# Altium schematic sheet Motor_Driver_Schematic.SchDoc
size A; DocumentNumber: 4; SheetNumber: 4; SheetTotal: 4
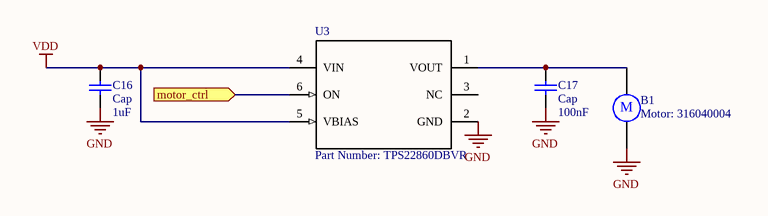
[diagram p0: Motor_Driver_Schematic.SchDoc]

## Parts
B1  Motor: 316040004  [RB5-10.5]
C16  Cap  value 1uF  [C0805]
C17  Cap  value 100nF  [C0805]
U3  Part Number: TPS22860DBVR  [DBV0006A_N]

## Ports
motor_ctrl (in)

## Nets
GND: B1.2 C16.1 C17.1 U3.2(GND)
VDD: C16.2 U3.4(VIN) U3.5(VBIAS)
motor_ctrl: U3.6(ON) ; port motor_ctrl
NetB1_1: B1.1 C17.2 U3.1(VOUT)

Not connected (* = marked no-connect by the designer): U3 3(NC)

## Notes on the sheet
- (in symbol Motor) M

## Library data of the parts
B1 = Motor: Motor, General Kind; Published: 24-Mar-1999; LatestRevisionDate: 17-Jul-2002; LatestRevisionNote: Re-released for DXP Platform.; PackageReference: RB5-10.5; Publisher: Altium Limited; PackageDescription: Capacitor (Radial); 2 Leads
C16 C17 = Cap: Capacitor; Published: 8-Jun-2000; LatestRevisionDate: 17-Jul-2002; LatestRevisionNote: Re-released for DXP Platform.; PackageReference: RAD-0.3; Publisher: Altium Limited; PackageDescription: Radial Cap, Thru-Hole; 2 Leads; 0.3 in Pin Spacing
U3 = TPS22860DBVR: No Description Available; Vendor: Texas Instruments; Built_By: Texas_Instrument_Team; CompType: IC; Manufacturer_Part_Number: TPS22860DBVR; Copyright: Copyright (C) 2018 Accelerated Designs. All rights reserved; RefDes: RefDes; Type: DEV; Value: Value; Application_BuildNumber: *; PartNumber: TPS22860DBVR; PackageReference: DBV0006A; MountType: SMT; RoHS: Y; Manufacturer: Texas Instruments